# Altium schematic sheet MCU.SchDoc
size A; SheetNumber: 2; SheetTotal: 3; SPICEModelCacheIZEWMZVA: <root> / <DocumentId>IZEWMZVA</DocumentId> / </root>
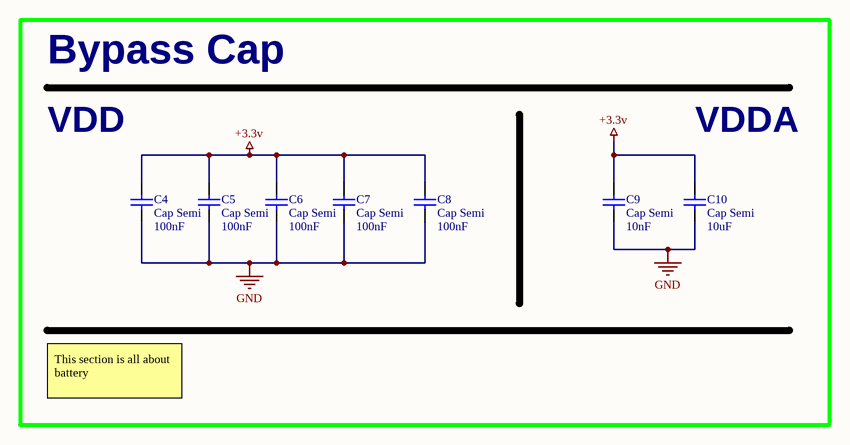
[diagram p0: MCU.SchDoc]

## Parts
C4  Cap Semi  value 100nF  [1608[0603]cap]
C5  Cap Semi  value 100nF  [1608[0603]cap]
C6  Cap Semi  value 100nF  [1608[0603]cap]
C7  Cap Semi  value 100nF  [1608[0603]cap]
C8  Cap Semi  value 100nF  [1608[0603]cap]
C9  Cap Semi  value 10nF  [1608[0603]cap]
C10  Cap Semi  value 10uF  [1608[0603]cap]

## Nets
+3.3v: C4.2 C5.2 C6.2 C7.2 C8.2 C9.2 C10.2
GND: C4.1 C5.1 C6.1 C7.1 C8.1 C9.1 C10.1

## Notes on the sheet
- Bypass Cap
- VDD
- VDDA
- This section is all about battery

## Library data of the parts
C4-C10 = Cap Semi: Capacitor (Semiconductor SIM Model); Published: 8-Jun-2000; LatestRevisionDate: 29-May-2009; LatestRevisionNote: IPC-7351 Footprint Added.; PackageReference: C1206; Publisher: Altium Limited; PackageDescription: Chip Capacitor